# Altium schematic sheet DigitalCarrierJack.SchDoc
size A4; CompanyName: Technische Hochschule Nürnberg Georg Simon Ohm; Organization: UltraZohm; Address1: Kesslerplatz 12; Address2: 90489 Nürnberg; Address3: GERMANY; Website: www.ultrazohm.com
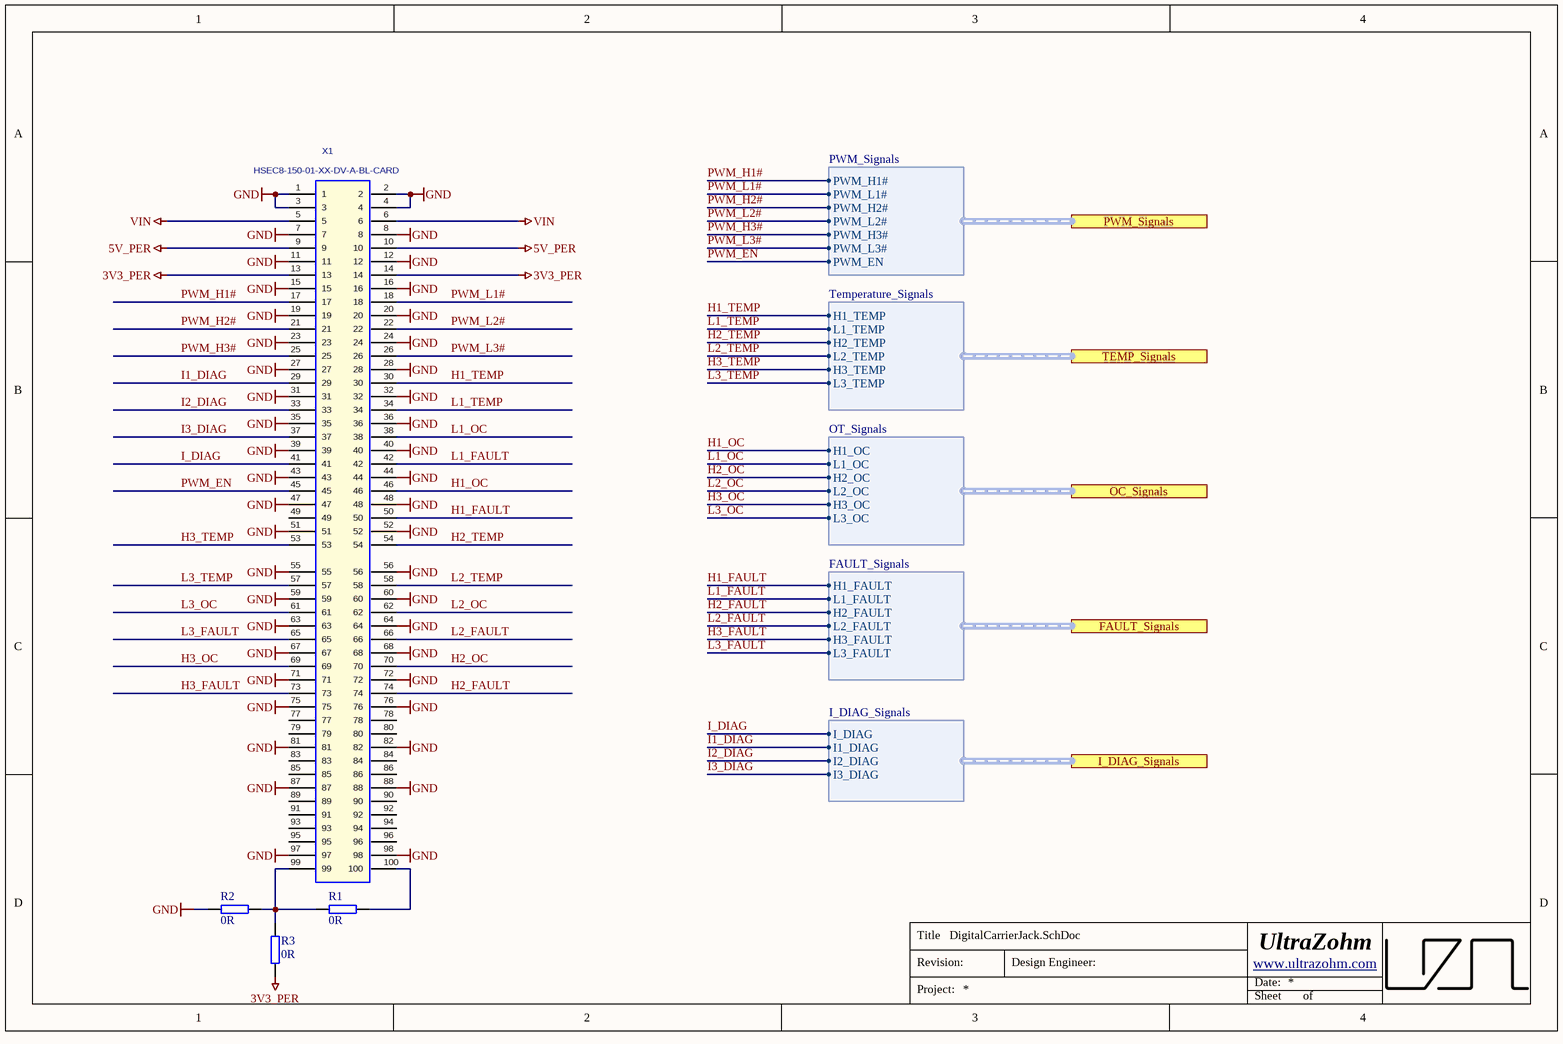
[diagram p0: DigitalCarrierJack.SchDoc]

## Parts
R1  0R  [RES 0603_1608]
R2  0R  [RES 0603_1608]
R3  0R  [RES 0603_1608]
X1  HSEC8-150-01-XX-DV-A-BL-CARD  [HSEC8-150-01-XX-DV-A-BL-CARD]  (no BOM)

## Ports
FAULT_Signals (harness FAULT_Signals), I_DIAG_Signals (harness I_DIAG_Signals), OC_Signals (harness OT_Signals), PWM_Signals (harness PWM_Signals), TEMP_Signals (harness Temperature_Signals)

## Harnesses
PWM_Signals: PWM_L1#, PWM_H2#, PWM_L2#, PWM_H3#, PWM_L3#, PWM_H1#, PWM_EN
Temperature_Signals: L1_TEMP, H2_TEMP, L2_TEMP, H3_TEMP, L3_TEMP, H1_TEMP
OT_Signals: L1_OC, H2_OC, L2_OC, H3_OC, L3_OC, H1_OC
FAULT_Signals: L1_FAULT, H2_FAULT, L2_FAULT, H3_FAULT, L3_FAULT, H1_FAULT
I_DIAG_Signals: I1_DIAG, I2_DIAG, I3_DIAG, I_DIAG

## Nets
3V3_PER: R3.1 X1.13 X1.14
5V_PER: X1.9 X1.10
GND: R2.1 X1.1 X1.2 X1.3 X1.4 X1.7 X1.8 X1.11 X1.12 X1.15 X1.16 X1.19 X1.20 X1.23 X1.24 X1.27 X1.28 X1.31 X1.32 X1.35 X1.36 X1.39 X1.40 X1.43 X1.44 X1.47 X1.48 X1.51 X1.52 X1.55 X1.56 X1.59 X1.60 X1.63 X1.64 X1.67 X1.68 X1.71 X1.72 X1.75 X1.76 X1.81 X1.82 X1.87 X1.88 X1.97 X1.98
VIN: X1.5 X1.6
H1_FAULT: X1.50 ; port FAULT_Signals.H1_FAULT
H1_OC: X1.46 ; port OC_Signals.H1_OC
H1_TEMP: X1.30 ; port TEMP_Signals.H1_TEMP
H2_FAULT: X1.74 ; port FAULT_Signals.H2_FAULT
H2_OC: X1.70 ; port OC_Signals.H2_OC
H2_TEMP: X1.54 ; port TEMP_Signals.H2_TEMP
H3_FAULT: X1.73 ; port FAULT_Signals.H3_FAULT
H3_OC: X1.69 ; port OC_Signals.H3_OC
H3_TEMP: X1.53 ; port TEMP_Signals.H3_TEMP
I1_DIAG: X1.29 ; port I_DIAG_Signals.I1_DIAG
I2_DIAG: X1.33 ; port I_DIAG_Signals.I2_DIAG
I3_DIAG: X1.37 ; port I_DIAG_Signals.I3_DIAG
I_DIAG: X1.41 ; port I_DIAG_Signals.I_DIAG
L1_FAULT: X1.42 ; port FAULT_Signals.L1_FAULT
L1_OC: X1.38 ; port OC_Signals.L1_OC
L1_TEMP: X1.34 ; port TEMP_Signals.L1_TEMP
L2_FAULT: X1.66 ; port FAULT_Signals.L2_FAULT
L2_OC: X1.62 ; port OC_Signals.L2_OC
L2_TEMP: X1.58 ; port TEMP_Signals.L2_TEMP
L3_FAULT: X1.65 ; port FAULT_Signals.L3_FAULT
L3_OC: X1.61 ; port OC_Signals.L3_OC
L3_TEMP: X1.57 ; port TEMP_Signals.L3_TEMP
PWM_EN: X1.45 ; port PWM_Signals.PWM_EN
PWM_H1#: X1.17 ; port PWM_Signals.PWM_H1#
PWM_H2#: X1.21 ; port PWM_Signals.PWM_H2#
PWM_H3#: X1.25 ; port PWM_Signals.PWM_H3#
PWM_L1#: X1.18 ; port PWM_Signals.PWM_L1#
PWM_L2#: X1.22 ; port PWM_Signals.PWM_L2#
PWM_L3#: X1.26 ; port PWM_Signals.PWM_L3#
NetR1_1: R1.1 R2.2 R3.2 X1.99
NetR1_2: R1.2 X1.100

Not connected (* = marked no-connect by the designer): X1 49 77 78 79 80 83 84 85 86 89 90 91 92 93 94 95 96

## Notes on the sheet
- Title
- Revision:
- Design Engineer:
- Date:
- Project:
- Sheet
- of

## Library data of the parts
R1-R3 = RC0603JR-070RL: SMD resistor E24 series; Manufacturer: YAGEO; Tolerance: 5%; Created from: MGremer; Manufacturer Part Number: RC0603JR-070RL; PartID: 1; Created On: 14.12.2020 16:17:14; ComponentLink1Description: Datasheet; ComponentLink1URL: https://www.mouser.de/datasheet/2/447/PYu-RC_Group_51_RoHS_L_10-1664068.pdf; Component Type: SMD resistor; Device Package: 0603; Last Updated: 04.03.2021 09:09:42; Mounting Type: SMD; Supplier 1: Mouser; Supplier Part Number 1: 603-RC0603JR-070RL; Supplier 2: LCSC; Supplier Part Number 2: C21189; Type: Resistor; Value: 0R; Live Cycle Status: 1; Stock number: Labor SMD Container; LCSC Part Number: C21189
X1 = HSEC8-150-01-XX-DV-A-BL-CARD: Mating Card Layout for HSEC8-150-01-XX-DV-A-BL; Manufacturer: SAMTEC; Created: 2018_04_23_AGeiger; Value: HSEC8-150-01-XX-DV-A-BL-CARD